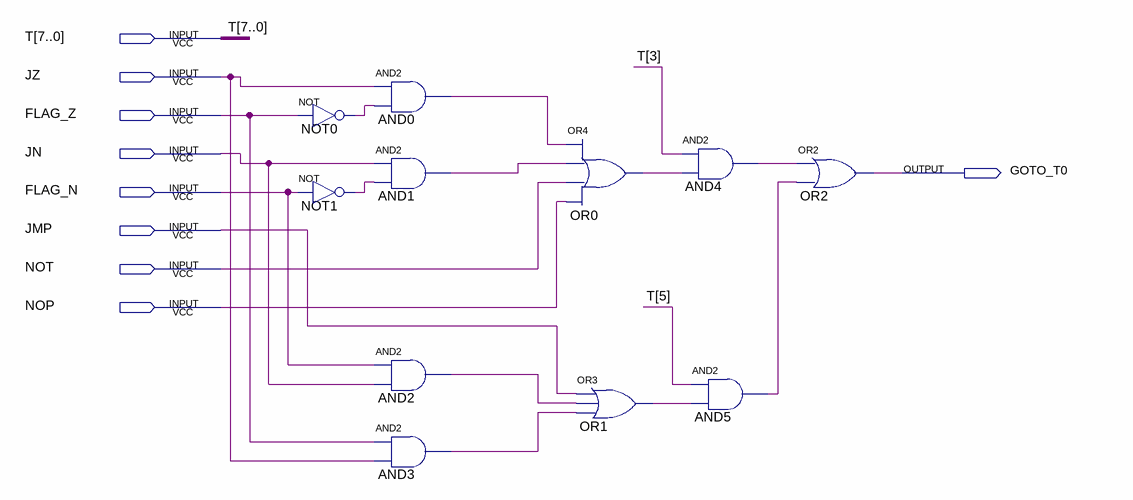
[diagram p0: schematic sheet]
// Quartus schematic GOTO_T0.bdf as structural Verilog: 11 symbols, 9 pins
module GOTO_T0 (
  input  [7:0] T,
  input  JZ,
  input  FLAG_Z,
  input  JN,
  input  FLAG_N,
  input  JMP,
  input  NOT,
  input  NOP,
  output GOTO_T0
);

  wire AND0_out, AND1_out, AND2_out, AND3_out, AND4_out, AND5_out, NOT0_out, NOT1_out, OR0_out, OR1_out;

  not NOT0 (NOT0_out, FLAG_Z);
  not NOT1 (NOT1_out, FLAG_N);
  and AND0 (AND0_out, JZ, NOT0_out);
  and AND1 (AND1_out, JN, NOT1_out);
  and AND2 (AND2_out, FLAG_N, JN);
  and AND3 (AND3_out, FLAG_Z, JZ);
  or OR0 (OR0_out, AND0_out, AND1_out, NOT, NOP);
  or OR1 (OR1_out, JMP, AND2_out, AND3_out);
  and AND4 (AND4_out, T[3], OR0_out);
  and AND5 (AND5_out, T[5], OR1_out);
  or OR2 (GOTO_T0, AND4_out, AND5_out);
endmodule
